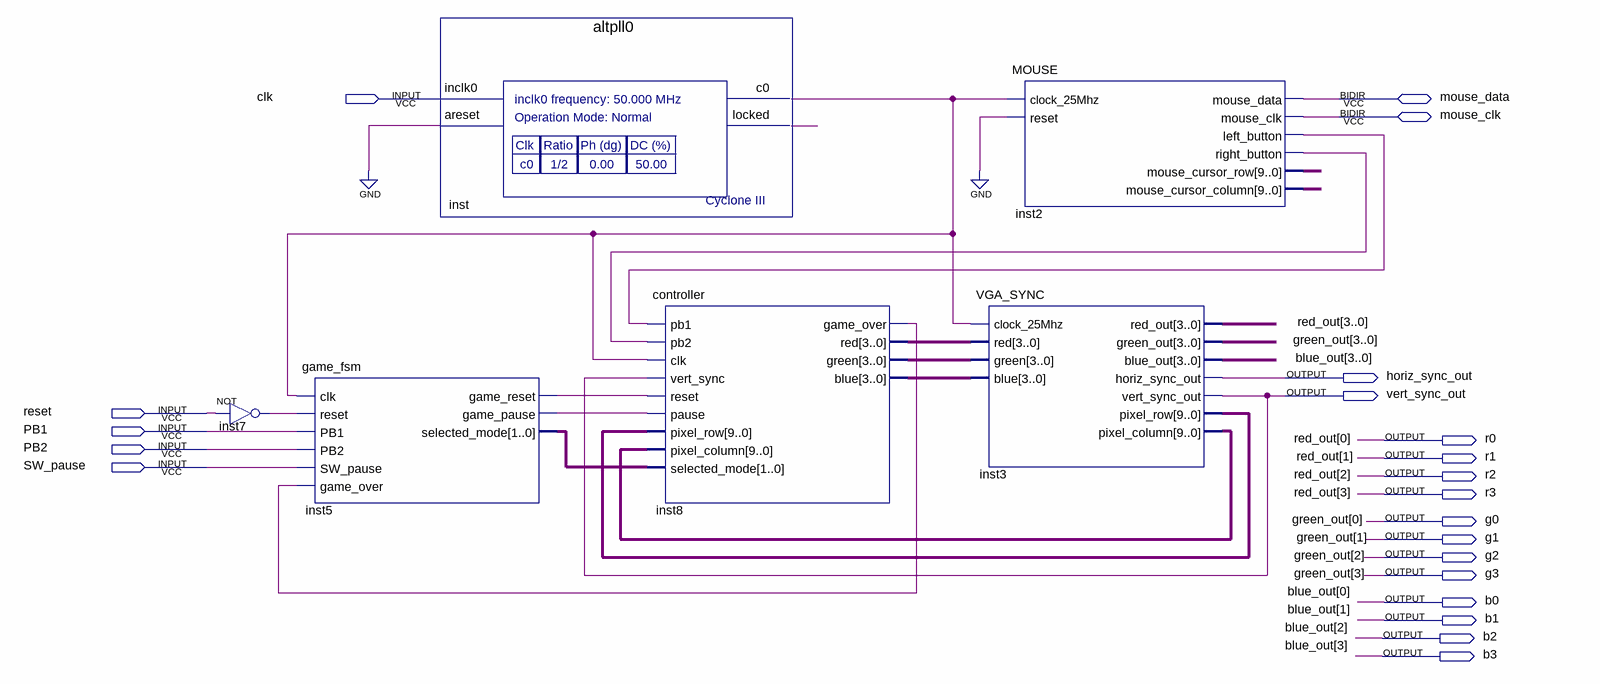
[diagram p0: schematic sheet]
// Quartus schematic Main.bdf as structural Verilog: 6 symbols, 21 pins
module Main (
  input  clk,
  input  reset,
  input  PB1,
  input  PB2,
  input  SW_pause,
  inout  mouse_data,
  inout  mouse_clk,
  output horiz_sync_out,
  output vert_sync_out,
  output r0,
  output r1,
  output r2,
  output r3,
  output g0,
  output g1,
  output g2,
  output g3,
  output b0,
  output b1,
  output b2,
  output b3
);

  wire inst2_left_button, inst2_right_button, inst5_game_pause, inst5_game_reset, inst7_out, inst8_game_over,
       inst_c0, inst_locked;
  wire [1:0] inst5_selected_mode;
  wire [3:0] inst8_blue, inst8_green, inst8_red;
  wire [9:0] inst2_mouse_cursor_column, inst2_mouse_cursor_row, inst3_pixel_column, inst3_pixel_row;

  not inst7 (inst7_out, reset);
  game_fsm inst5 (
    .clk(inst_c0), .reset(inst7_out), .PB1(PB1), .PB2(PB2), .SW_pause(SW_pause), .game_over(inst8_game_over),
    .game_reset(inst5_game_reset), .game_pause(inst5_game_pause), .selected_mode(inst5_selected_mode));
  altpll0 inst (.inclk0(clk), .areset(1'b0), .c0(inst_c0), .locked(inst_locked));
  controller inst8 (
    .pb1(inst2_left_button), .pb2(inst2_right_button), .clk(inst_c0), .vert_sync(vert_sync_out),
    .reset(inst5_game_reset), .pause(inst5_game_pause), .pixel_row(inst3_pixel_row),
    .pixel_column(inst3_pixel_column), .selected_mode(inst5_selected_mode), .game_over(inst8_game_over),
    .red(inst8_red), .green(inst8_green), .blue(inst8_blue));
  VGA_SYNC inst3 (
    .clock_25Mhz(inst_c0), .red(inst8_red), .green(inst8_green), .blue(inst8_blue),
    .red_out({r3, r2, r1, r0}), .green_out({g3, g2, g1, g0}), .blue_out({b3, b2, b1, b0}),
    .horiz_sync_out(horiz_sync_out), .vert_sync_out(vert_sync_out), .pixel_row(inst3_pixel_row),
    .pixel_column(inst3_pixel_column));
  MOUSE inst2 (
    .clock_25Mhz(inst_c0), .reset(1'b0), .left_button(inst2_left_button), .right_button(inst2_right_button),
    .mouse_cursor_row(inst2_mouse_cursor_row), .mouse_cursor_column(inst2_mouse_cursor_column),
    .mouse_data(mouse_data), .mouse_clk(mouse_clk));

  // Other names for the same wires on the sheet: blue_out[3:0] = {b3, b2, b1, b0}; green_out[3:0] = {g3, g2, g1, g0};
  //   red_out[3:0] = {r3, r2, r1, r0}
endmodule
